# Altium schematic sheet Э1.SchDoc: =title_line_1 + title_line_2
size 420 x 297 mm; ApprovedBy: Мерзлякова; CheckedBy: Площадная; DrawnBy: Площадная; DocumentNumber: Э1; SheetNumber: 1; SheetTotal: 1; check: Андриенко; title_line_1: плата; title_line_2: ЕТЗ; document_type: схема электрическая структурная
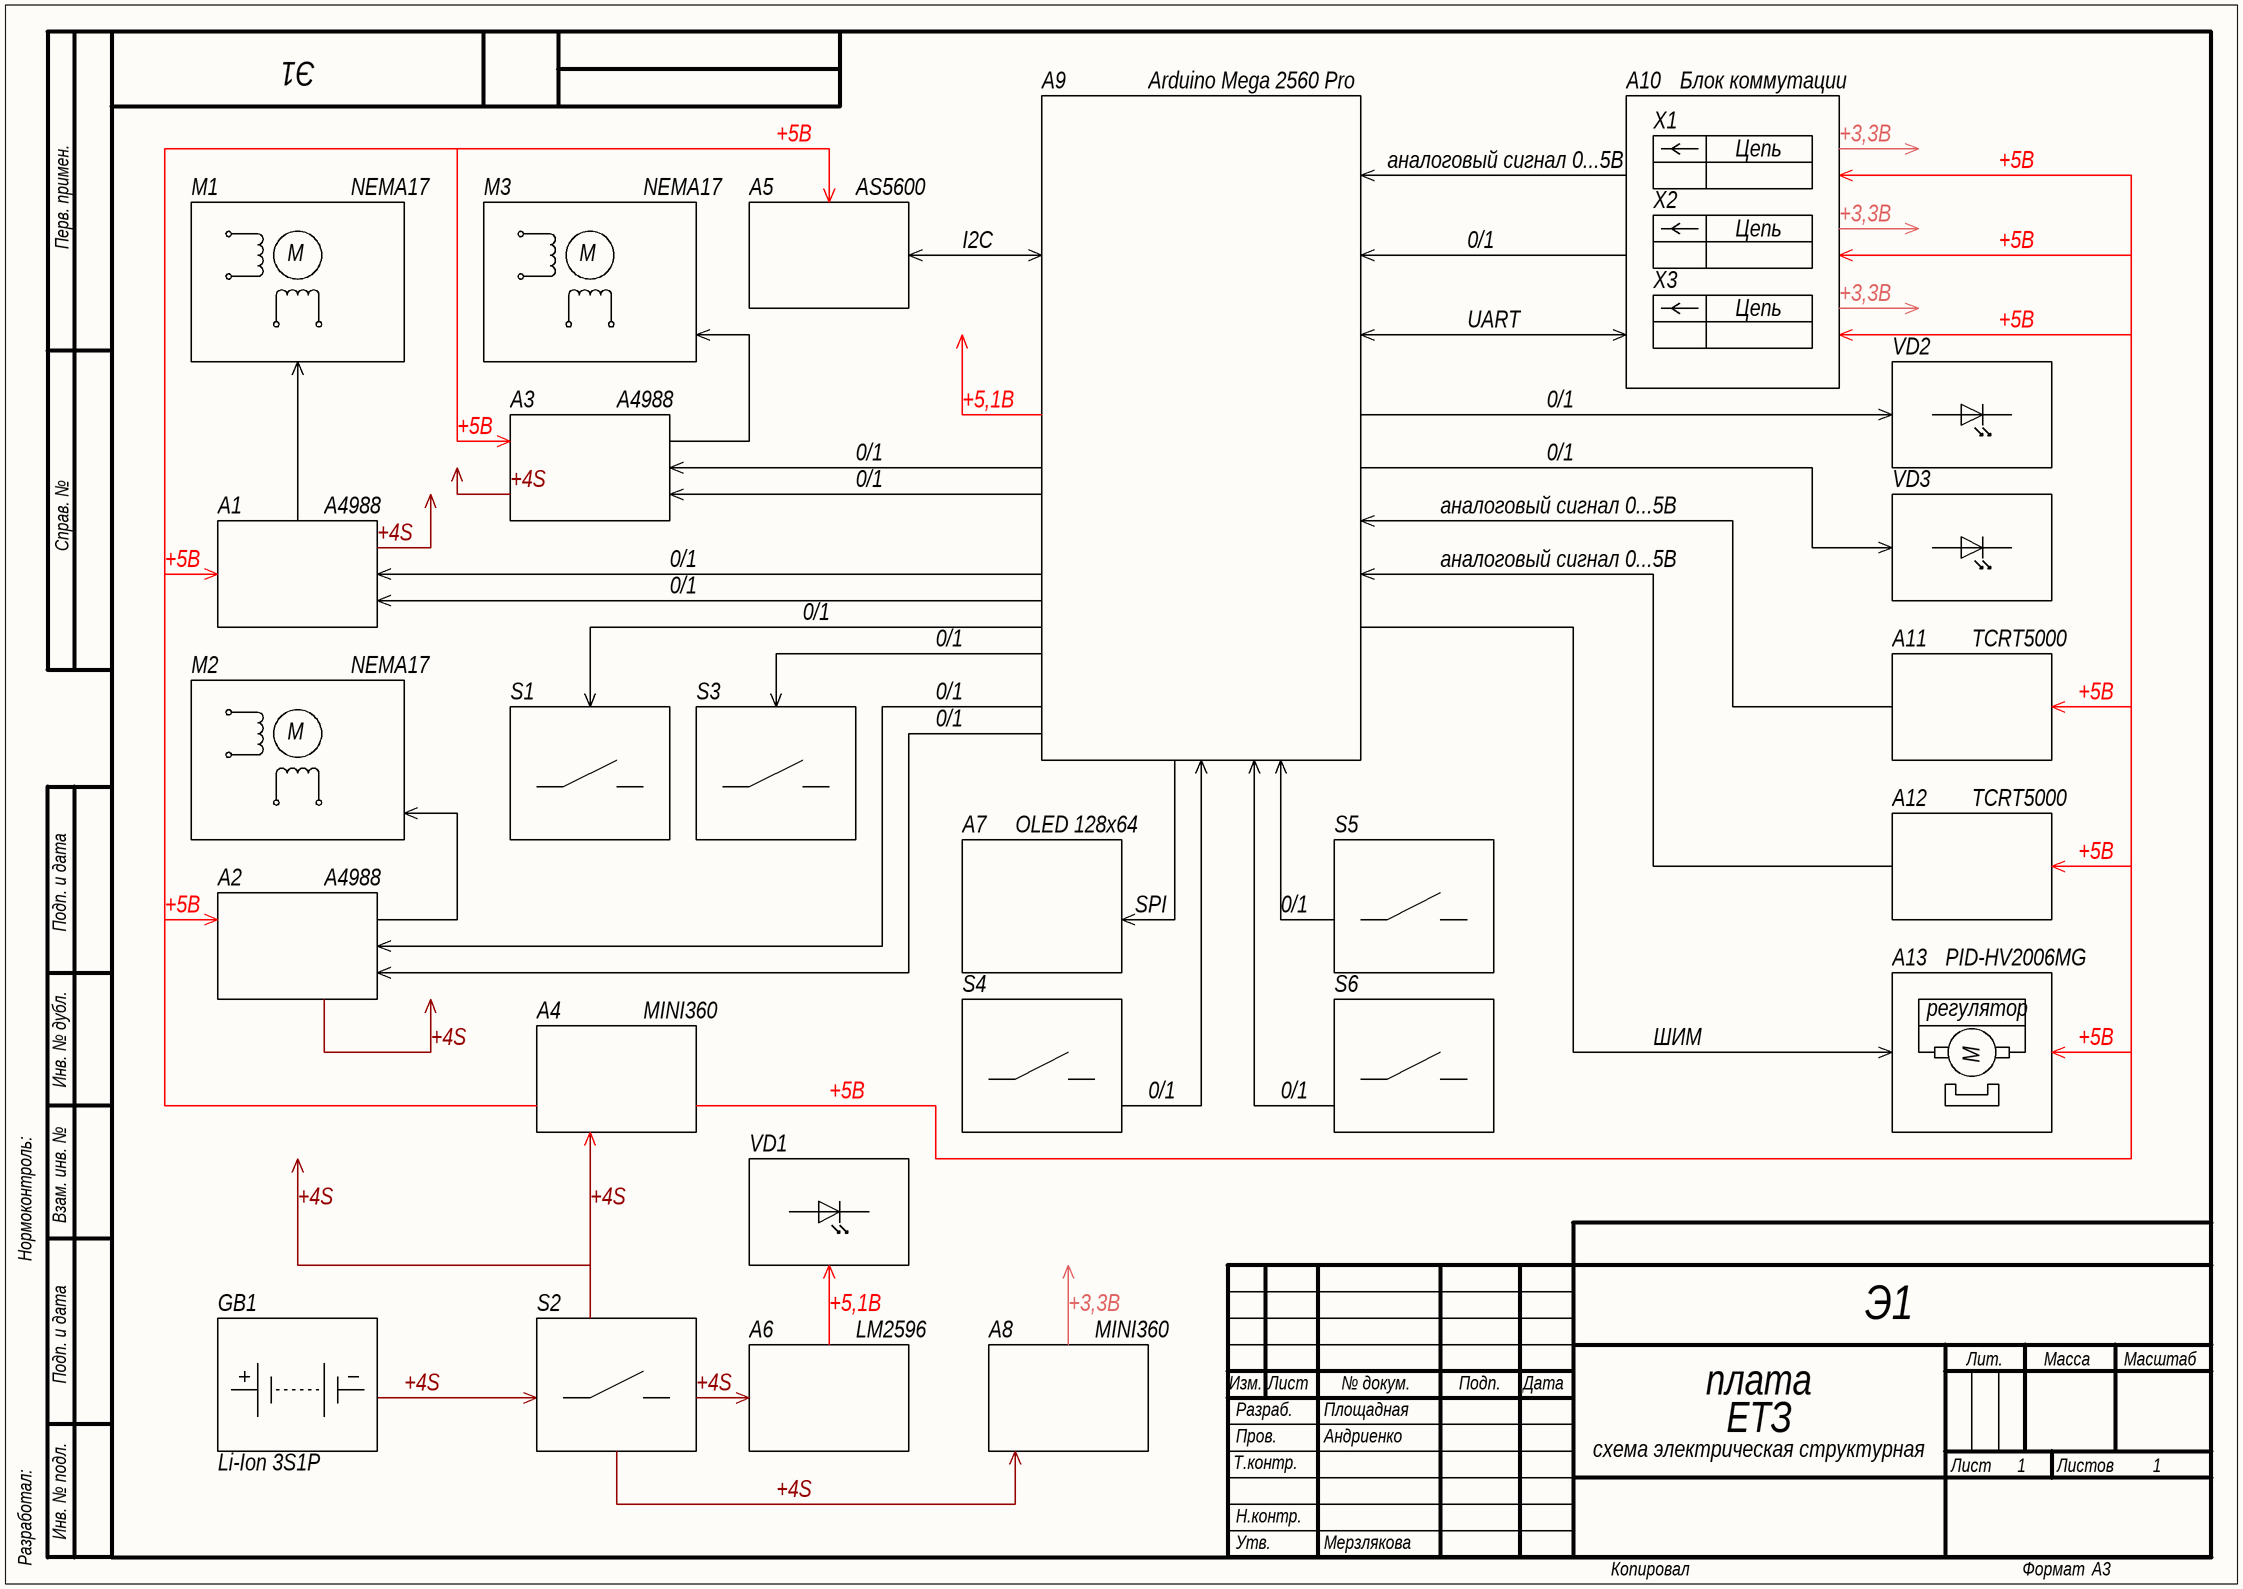
[diagram p0: Э1.SchDoc]

## Parts
M1  мотор  [terminal-block]  (value not drawn)

## Nets

Not connected (* = marked no-connect by the designer): M1 1 2

## Notes on the sheet
- A9
- Arduino Mega 2560 Pro
- A10
- Блок коммутации
- +5В
- аналоговый сигнал 0...5В
- X1
- Цепь
- +3,3В
- M1
- NEMA17
- M3
- A5
- AS5600
- I2C
- 0/1
- X2
- М
- UART
- X3
- VD2
- A3
- A4988
- +5,1В
- A1
- +4S
- VD3
- A11
- TCRT5000
- M2
- S1
- S3
- A7
- OLED 128х64
- S5
- A12
- A2
- SPI
- S4
- S6
- A13
- PID-HV2006MG
- A4
- MINI360
- ШИМ
- (near M1) регулятор
- VD1
- GB1
- S2
- A6
- LM2596
- A8
- Li-Ion 3S1P
- Перв. примен.
- Справ. №
- Подп. и дата
- Инв. № дубл.
- Нормоконтроль:
- Взам. инв. №
- Изм.
- Лист
- № докум.
- Подп.
- Дата
- Лит.
- Масса
- Масштаб
- Т.контр.
- Пров.
- Разраб.
- Листов
- Разработал:
- Инв. № подл.
- Н.контр.
- Утв.
- Копировал
- Формат
- А3
- (in symbol MOTOR) M

## Library data of the parts
M1 = MOTOR: nam: мотор